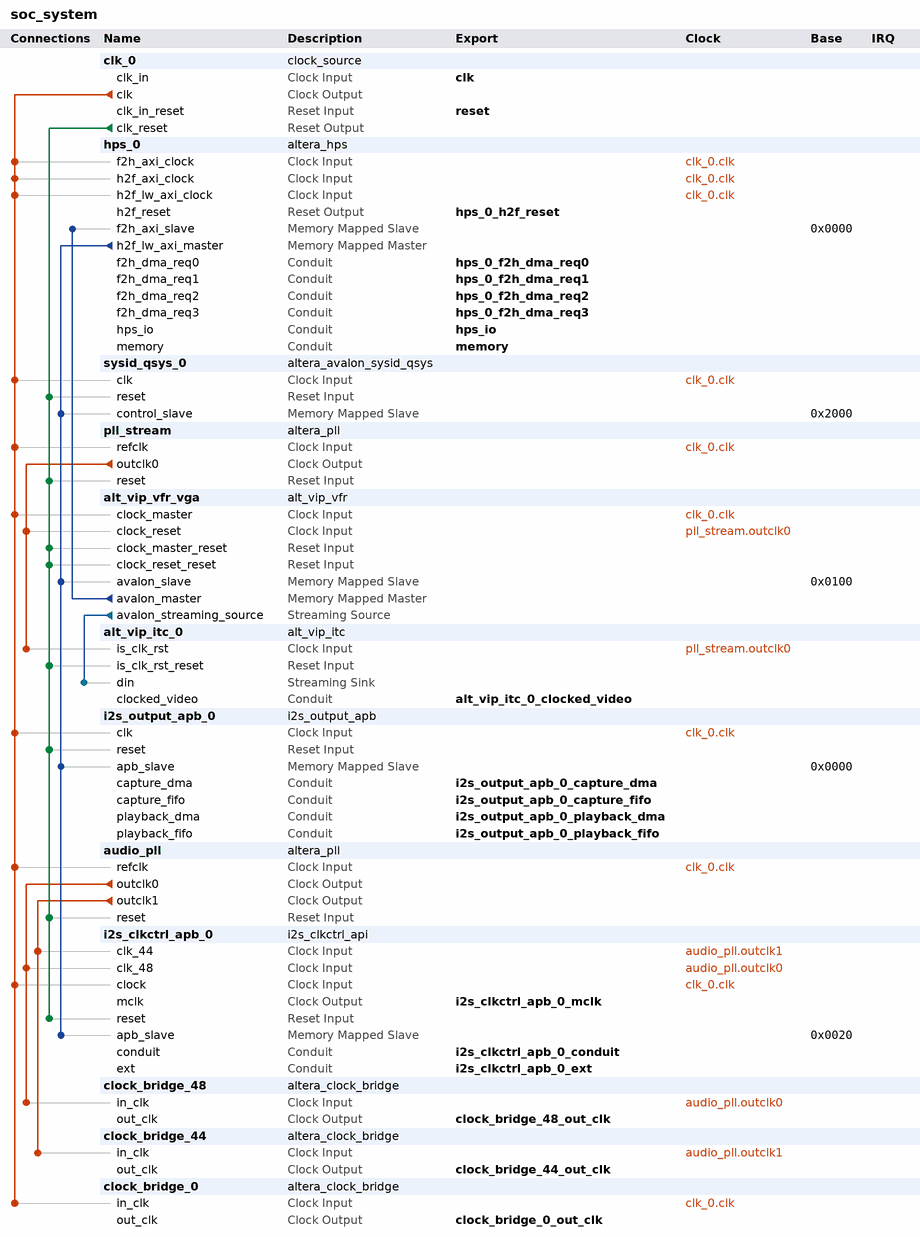
[diagram p0: system contents]
# Platform Designer (Qsys) system soc_system, Cyclone V 5CSEMA5F31C6
# Parameters at their usual value, and those the tool derives, are not listed.
package require -exact qsys 14.1
create_system soc_system
set_project_property DEVICE_FAMILY {Cyclone V}
set_project_property DEVICE 5CSEMA5F31C6

add_instance clk_0 clock_source 14.1
set_instance_parameter_value clk_0 clockFrequency 50000000

add_instance hps_0 altera_hps 14.1
set_instance_parameter_value hps_0 DMA_Enable Yes,Yes,Yes,Yes,No,No,No,No
set_instance_parameter_value hps_0 EMAC1_Mode RGMII
set_instance_parameter_value hps_0 EMAC1_PinMuxing {HPS I/O Set 0}
set_instance_parameter_value hps_0 F2SCLK_COLDRST_Enable false
set_instance_parameter_value hps_0 F2SCLK_DBGRST_Enable false
set_instance_parameter_value hps_0 F2SCLK_WARMRST_Enable false
set_instance_parameter_value hps_0 F2SINTERRUPT_Enable true
set_instance_parameter_value hps_0 F2S_Width 3
set_instance_parameter_value hps_0 FPGA_PERIPHERAL_OUTPUT_CLOCK_FREQ_EMAC0_GTX_CLK 100
set_instance_parameter_value hps_0 FPGA_PERIPHERAL_OUTPUT_CLOCK_FREQ_EMAC0_MD_CLK 100
set_instance_parameter_value hps_0 FPGA_PERIPHERAL_OUTPUT_CLOCK_FREQ_EMAC1_GTX_CLK 100
set_instance_parameter_value hps_0 FPGA_PERIPHERAL_OUTPUT_CLOCK_FREQ_EMAC1_MD_CLK 100
set_instance_parameter_value hps_0 HPS_PROTOCOL DDR3
set_instance_parameter_value hps_0 I2C0_Mode I2C
set_instance_parameter_value hps_0 I2C0_PinMuxing {HPS I/O Set 0}
set_instance_parameter_value hps_0 I2C1_Mode I2C
set_instance_parameter_value hps_0 I2C1_PinMuxing {HPS I/O Set 0}
set_instance_parameter_value hps_0 LWH2F_Enable true
set_instance_parameter_value hps_0 MEM_BANKADDR_WIDTH 3
set_instance_parameter_value hps_0 MEM_CLK_FREQ 400.0
set_instance_parameter_value hps_0 MEM_COL_ADDR_WIDTH 10
set_instance_parameter_value hps_0 MEM_DQ_WIDTH 32
set_instance_parameter_value hps_0 MEM_DRV_STR RZQ/7
set_instance_parameter_value hps_0 MEM_ROW_ADDR_WIDTH 15
set_instance_parameter_value hps_0 MEM_RTT_NOM RZQ/4
set_instance_parameter_value hps_0 MEM_RTT_WR RZQ/4
set_instance_parameter_value hps_0 MEM_TCL 11
set_instance_parameter_value hps_0 MEM_TFAW_NS 30.0
set_instance_parameter_value hps_0 MEM_TRAS_NS 35.0
set_instance_parameter_value hps_0 MEM_TRCD_NS 13.75
set_instance_parameter_value hps_0 MEM_TRFC_NS 260.0
set_instance_parameter_value hps_0 MEM_TRP_NS 13.75
set_instance_parameter_value hps_0 MEM_VENDOR JEDEC
set_instance_parameter_value hps_0 MEM_WTCL 8
set_instance_parameter_value hps_0 QSPI_Mode {1 SS}
set_instance_parameter_value hps_0 QSPI_PinMuxing {HPS I/O Set 0}
set_instance_parameter_value hps_0 REF_CLK_FREQ 25.0
set_instance_parameter_value hps_0 S2F_Width 2
set_instance_parameter_value hps_0 SDIO_Mode {4-bit Data}
set_instance_parameter_value hps_0 SDIO_PinMuxing {HPS I/O Set 0}
set_instance_parameter_value hps_0 SPIM1_Mode {Single Slave Select}
set_instance_parameter_value hps_0 SPIM1_PinMuxing {HPS I/O Set 0}
set_instance_parameter_value hps_0 STM_Enable false
set_instance_parameter_value hps_0 TIMING_BOARD_AC_SKEW 0.03
set_instance_parameter_value hps_0 TIMING_BOARD_AC_TO_CK_SKEW 0.0
set_instance_parameter_value hps_0 TIMING_BOARD_DQ_TO_DQS_SKEW 0.0
set_instance_parameter_value hps_0 TIMING_BOARD_MAX_CK_DELAY 0.03
set_instance_parameter_value hps_0 TIMING_BOARD_MAX_DQS_DELAY 0.02
set_instance_parameter_value hps_0 TIMING_BOARD_SKEW_BETWEEN_DQS 0.08
set_instance_parameter_value hps_0 TIMING_BOARD_SKEW_CKDQS_DIMM_MAX 0.16
set_instance_parameter_value hps_0 TIMING_BOARD_SKEW_CKDQS_DIMM_MIN 0.09
set_instance_parameter_value hps_0 TIMING_BOARD_SKEW_WITHIN_DQS 0.01
set_instance_parameter_value hps_0 TIMING_TDH 65
set_instance_parameter_value hps_0 TIMING_TDQSCK 255
set_instance_parameter_value hps_0 TIMING_TDQSQ 125
set_instance_parameter_value hps_0 TIMING_TDS 30
set_instance_parameter_value hps_0 TIMING_TIH 140
set_instance_parameter_value hps_0 TIMING_TIS 180
set_instance_parameter_value hps_0 TIMING_TQSH 0.4
set_instance_parameter_value hps_0 UART0_Mode {No Flow Control}
set_instance_parameter_value hps_0 UART0_PinMuxing {HPS I/O Set 0}
set_instance_parameter_value hps_0 USB1_Mode SDR
set_instance_parameter_value hps_0 USB1_PinMuxing {HPS I/O Set 0}
set_instance_parameter_value hps_0 desired_cfg_clk_mhz 100.0
set_instance_parameter_value hps_0 desired_qspi_clk_mhz 400.0

add_instance sysid_qsys_0 altera_avalon_sysid_qsys 14.1
set_instance_parameter_value sysid_qsys_0 id -559038737

add_instance pll_stream altera_pll 14.1
set_instance_parameter_value pll_stream gui_device_speed_grade 1
set_instance_parameter_value pll_stream gui_number_of_clocks 1
set_instance_parameter_value pll_stream gui_operation_mode direct
set_instance_parameter_value pll_stream gui_output_clock_frequency0 130.0
set_instance_parameter_value pll_stream gui_pll_mode {Integer-N PLL}
set_instance_parameter_value pll_stream gui_reference_clock_frequency 50.0
set_instance_parameter_value pll_stream gui_use_locked false

add_instance alt_vip_vfr_vga alt_vip_vfr 14.0
set_instance_parameter_value alt_vip_vfr_vga MAX_IMAGE_WIDTH 1024

add_instance alt_vip_itc_0 alt_vip_itc 14.0
set_instance_parameter_value alt_vip_itc_0 FIFO_DEPTH 1920
set_instance_parameter_value alt_vip_itc_0 H_ACTIVE_PIXELS 1024
set_instance_parameter_value alt_vip_itc_0 H_BACK_PORCH 168
set_instance_parameter_value alt_vip_itc_0 H_FRONT_PORCH 24
set_instance_parameter_value alt_vip_itc_0 H_SYNC_LENGTH 136
set_instance_parameter_value alt_vip_itc_0 NUMBER_OF_COLOUR_PLANES 4
set_instance_parameter_value alt_vip_itc_0 THRESHOLD 1919
set_instance_parameter_value alt_vip_itc_0 V_ACTIVE_LINES 768
set_instance_parameter_value alt_vip_itc_0 V_BACK_PORCH 29
set_instance_parameter_value alt_vip_itc_0 V_FRONT_PORCH 3
set_instance_parameter_value alt_vip_itc_0 V_SYNC_LENGTH 6

add_instance i2s_output_apb_0 i2s_output_apb 1.4

add_instance audio_pll altera_pll 14.1
set_instance_parameter_value audio_pll gui_device_speed_grade 1
set_instance_parameter_value audio_pll gui_number_of_clocks 2
set_instance_parameter_value audio_pll gui_operation_mode direct
set_instance_parameter_value audio_pll gui_output_clock_frequency0 24.576
set_instance_parameter_value audio_pll gui_output_clock_frequency1 33.8688
set_instance_parameter_value audio_pll gui_pll_mode {Integer-N PLL}
set_instance_parameter_value audio_pll gui_reference_clock_frequency 50.0
set_instance_parameter_value audio_pll gui_use_locked false

add_instance i2s_clkctrl_apb_0 i2s_clkctrl_api 1.7

add_instance clock_bridge_48 altera_clock_bridge 14.1
set_instance_parameter_value clock_bridge_48 DERIVED_CLOCK_RATE 24576271
set_instance_parameter_value clock_bridge_48 EXPLICIT_CLOCK_RATE 0

add_instance clock_bridge_44 altera_clock_bridge 14.1
set_instance_parameter_value clock_bridge_44 DERIVED_CLOCK_RATE 33720930
set_instance_parameter_value clock_bridge_44 EXPLICIT_CLOCK_RATE 0

add_instance clock_bridge_0 altera_clock_bridge 14.1
set_instance_parameter_value clock_bridge_0 DERIVED_CLOCK_RATE 50000000
set_instance_parameter_value clock_bridge_0 EXPLICIT_CLOCK_RATE 0

# connections
add_connection audio_pll.outclk0 clock_bridge_48.in_clk clock
add_connection audio_pll.outclk0 i2s_clkctrl_apb_0.clk_48 clock
add_connection audio_pll.outclk1 clock_bridge_44.in_clk clock
add_connection audio_pll.outclk1 i2s_clkctrl_apb_0.clk_44 clock
add_connection clk_0.clk alt_vip_vfr_vga.clock_master clock
add_connection clk_0.clk audio_pll.refclk clock
add_connection clk_0.clk clock_bridge_0.in_clk clock
add_connection clk_0.clk hps_0.f2h_axi_clock clock
add_connection clk_0.clk hps_0.h2f_axi_clock clock
add_connection clk_0.clk hps_0.h2f_lw_axi_clock clock
add_connection clk_0.clk i2s_clkctrl_apb_0.clock clock
add_connection clk_0.clk i2s_output_apb_0.clk clock
add_connection clk_0.clk pll_stream.refclk clock
add_connection clk_0.clk sysid_qsys_0.clk clock
add_connection pll_stream.outclk0 alt_vip_itc_0.is_clk_rst clock
add_connection pll_stream.outclk0 alt_vip_vfr_vga.clock_reset clock
add_connection clk_0.clk_reset alt_vip_itc_0.is_clk_rst_reset reset
add_connection clk_0.clk_reset alt_vip_vfr_vga.clock_master_reset reset
add_connection clk_0.clk_reset alt_vip_vfr_vga.clock_reset_reset reset
add_connection clk_0.clk_reset audio_pll.reset reset
add_connection clk_0.clk_reset i2s_clkctrl_apb_0.reset reset
add_connection clk_0.clk_reset i2s_output_apb_0.reset reset
add_connection clk_0.clk_reset pll_stream.reset reset
add_connection clk_0.clk_reset sysid_qsys_0.reset reset
add_connection alt_vip_vfr_vga.avalon_master hps_0.f2h_axi_slave avalon
set_connection_parameter_value alt_vip_vfr_vga.avalon_master/hps_0.f2h_axi_slave baseAddress 0x0000
add_connection hps_0.h2f_lw_axi_master alt_vip_vfr_vga.avalon_slave avalon
set_connection_parameter_value hps_0.h2f_lw_axi_master/alt_vip_vfr_vga.avalon_slave baseAddress 0x0100
add_connection hps_0.h2f_lw_axi_master i2s_clkctrl_apb_0.apb_slave avalon
set_connection_parameter_value hps_0.h2f_lw_axi_master/i2s_clkctrl_apb_0.apb_slave baseAddress 0x0020
add_connection hps_0.h2f_lw_axi_master i2s_output_apb_0.apb_slave avalon
set_connection_parameter_value hps_0.h2f_lw_axi_master/i2s_output_apb_0.apb_slave baseAddress 0x0000
add_connection hps_0.h2f_lw_axi_master sysid_qsys_0.control_slave avalon
set_connection_parameter_value hps_0.h2f_lw_axi_master/sysid_qsys_0.control_slave baseAddress 0x2000
add_connection alt_vip_vfr_vga.avalon_streaming_source alt_vip_itc_0.din avalon_streaming

# exported interfaces
add_interface alt_vip_itc_0_clocked_video conduit end
set_interface_property alt_vip_itc_0_clocked_video EXPORT_OF alt_vip_itc_0.clocked_video
add_interface clk clock sink
set_interface_property clk EXPORT_OF clk_0.clk_in
add_interface clock_bridge_0_out_clk clock source
set_interface_property clock_bridge_0_out_clk EXPORT_OF clock_bridge_0.out_clk
add_interface clock_bridge_44_out_clk clock source
set_interface_property clock_bridge_44_out_clk EXPORT_OF clock_bridge_44.out_clk
add_interface clock_bridge_48_out_clk clock source
set_interface_property clock_bridge_48_out_clk EXPORT_OF clock_bridge_48.out_clk
add_interface hps_0_f2h_dma_req0 conduit end
set_interface_property hps_0_f2h_dma_req0 EXPORT_OF hps_0.f2h_dma_req0
add_interface hps_0_f2h_dma_req1 conduit end
set_interface_property hps_0_f2h_dma_req1 EXPORT_OF hps_0.f2h_dma_req1
add_interface hps_0_f2h_dma_req2 conduit end
set_interface_property hps_0_f2h_dma_req2 EXPORT_OF hps_0.f2h_dma_req2
add_interface hps_0_f2h_dma_req3 conduit end
set_interface_property hps_0_f2h_dma_req3 EXPORT_OF hps_0.f2h_dma_req3
add_interface hps_0_h2f_reset reset source
set_interface_property hps_0_h2f_reset EXPORT_OF hps_0.h2f_reset
add_interface hps_io conduit end
set_interface_property hps_io EXPORT_OF hps_0.hps_io
add_interface i2s_clkctrl_apb_0_conduit conduit end
set_interface_property i2s_clkctrl_apb_0_conduit EXPORT_OF i2s_clkctrl_apb_0.conduit
add_interface i2s_clkctrl_apb_0_ext conduit end
set_interface_property i2s_clkctrl_apb_0_ext EXPORT_OF i2s_clkctrl_apb_0.ext
add_interface i2s_clkctrl_apb_0_mclk clock source
set_interface_property i2s_clkctrl_apb_0_mclk EXPORT_OF i2s_clkctrl_apb_0.mclk
add_interface i2s_output_apb_0_capture_dma conduit end
set_interface_property i2s_output_apb_0_capture_dma EXPORT_OF i2s_output_apb_0.capture_dma
add_interface i2s_output_apb_0_capture_fifo conduit end
set_interface_property i2s_output_apb_0_capture_fifo EXPORT_OF i2s_output_apb_0.capture_fifo
add_interface i2s_output_apb_0_playback_dma conduit end
set_interface_property i2s_output_apb_0_playback_dma EXPORT_OF i2s_output_apb_0.playback_dma
add_interface i2s_output_apb_0_playback_fifo conduit end
set_interface_property i2s_output_apb_0_playback_fifo EXPORT_OF i2s_output_apb_0.playback_fifo
add_interface memory conduit end
set_interface_property memory EXPORT_OF hps_0.memory
add_interface reset reset sink
set_interface_property reset EXPORT_OF clk_0.clk_in_reset

set_interconnect_requirement {$system} qsys_mm.clockCrossingAdapter HANDSHAKE
set_interconnect_requirement {$system} qsys_mm.insertDefaultSlave FALSE
set_interconnect_requirement {$system} qsys_mm.maxAdditionalLatency 0

save_system soc_system.qsys
